# EAGLE design Beagle_ESC (EAGLE 9.0.0)
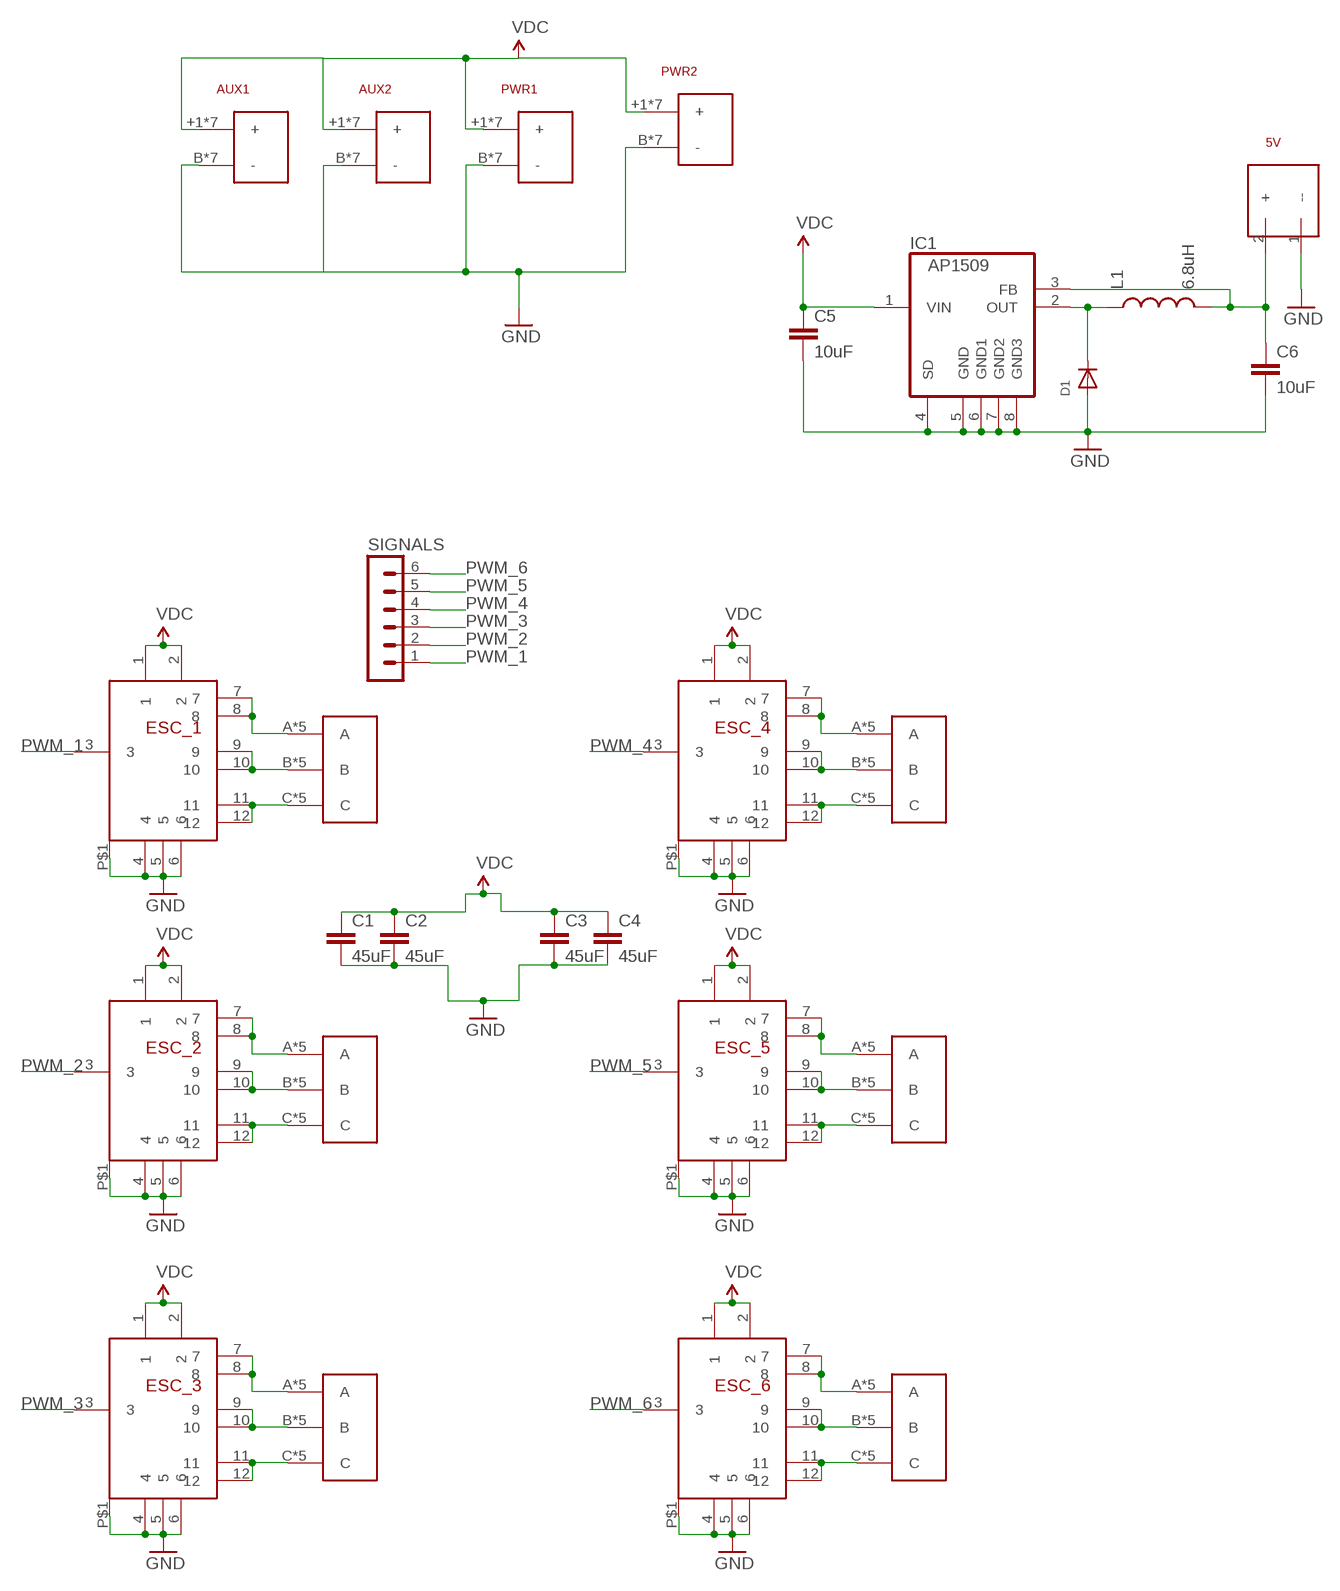
[diagram p0: schematic, sheet 1]

## Parts
1  3_PADS  [3_PADS]
2  3_PADS  [3_PADS]
3  3_PADS  [3_PADS]
4  3_PADS  [3_PADS]
5  3_PADS  [3_PADS]
5V  HEADER_PWR  [HEADER_PWR]
6  3_PADS  [3_PADS]
AUX1  2PADS  [2PADS]
AUX2  2PADS  [2PADS]
C1  45uF  CAP1206  [1206]
C2  45uF  CAP1206  [1206]
C3  45uF  CAP1206  [1206]
C4  45uF  CAP1206  [1206]
C5  10uF  CAP0805  [0805]
C6  10uF  CAP0805  [0805]
D1  DIODESOD-123  [SOD-123]
ESC_1  DYS_BLHELI_ESC  [DYS_BLHELI_ESC]
ESC_2  DYS_BLHELI_ESC  [DYS_BLHELI_ESC]
ESC_3  DYS_BLHELI_ESC  [DYS_BLHELI_ESC]
ESC_4  DYS_BLHELI_ESC  [DYS_BLHELI_ESC]
ESC_5  DYS_BLHELI_ESC  [DYS_BLHELI_ESC]
ESC_6  DYS_BLHELI_ESC  [DYS_BLHELI_ESC]
IC1  AP1509SOIC-8-TIGHT  [SO08-TIGHT]
L1  6.8uH  INDUCTORTAIYO_NR-S  [TAIYO_NRS]
PWR1  2PADS  [2PADS]
PWR2  2PADS  [2PADS]
SIGNALS  MA06-1  [MA06-1]

## Nets
1A: 1.A 1.P$4(A) 1.P$7(A) 1.P$8(A) 1.P$9(A) ESC_1.7 ESC_1.8
1B: 1.B 1.P$5(B) 1.P$10(B) 1.P$11(B) 1.P$12(B) ESC_1.9 ESC_1.10
1C: 1.C 1.P$6(C) 1.P$13(C) 1.P$14(C) 1.P$15(C) ESC_1.11 ESC_1.12
2A: 2.A 2.P$4(A) 2.P$7(A) 2.P$8(A) 2.P$9(A) ESC_2.7 ESC_2.8
2B: 2.B 2.P$5(B) 2.P$10(B) 2.P$11(B) 2.P$12(B) ESC_2.9 ESC_2.10
2C: 2.C 2.P$6(C) 2.P$13(C) 2.P$14(C) 2.P$15(C) ESC_2.11 ESC_2.12
3A: 3.A 3.P$4(A) 3.P$7(A) 3.P$8(A) 3.P$9(A) ESC_3.7 ESC_3.8
3B: 3.B 3.P$5(B) 3.P$10(B) 3.P$11(B) 3.P$12(B) ESC_3.9 ESC_3.10
3C: 3.C 3.P$6(C) 3.P$13(C) 3.P$14(C) 3.P$15(C) ESC_3.11 ESC_3.12
4A: 4.A 4.P$4(A) 4.P$7(A) 4.P$8(A) 4.P$9(A) ESC_4.7 ESC_4.8
4B: 4.B 4.P$5(B) 4.P$10(B) 4.P$11(B) 4.P$12(B) ESC_4.9 ESC_4.10
4C: 4.C 4.P$6(C) 4.P$13(C) 4.P$14(C) 4.P$15(C) ESC_4.11 ESC_4.12
5A: 5.A 5.P$4(A) 5.P$7(A) 5.P$8(A) 5.P$9(A) ESC_5.7 ESC_5.8
5B: 5.B 5.P$5(B) 5.P$10(B) 5.P$11(B) 5.P$12(B) ESC_5.9 ESC_5.10
5C: 5.C 5.P$6(C) 5.P$13(C) 5.P$14(C) 5.P$15(C) ESC_5.11 ESC_5.12
6A: 6.A 6.P$4(A) 6.P$7(A) 6.P$8(A) 6.P$9(A) ESC_6.7 ESC_6.8
6B: 6.B 6.P$5(B) 6.P$10(B) 6.P$11(B) 6.P$12(B) ESC_6.9 ESC_6.10
6C: 6.C 6.P$6(C) 6.P$13(C) 6.P$14(C) 6.P$15(C) ESC_6.11 ESC_6.12
GND: 5V.1(--) AUX1.B(-) AUX1.P$5(-) AUX1.P$10(-) AUX1.P$11(-) AUX1.P$12(-) AUX1.P$13(-) AUX1.P$14(-) AUX2.B(-) AUX2.P$5(-) AUX2.P$10(-) AUX2.P$11(-) AUX2.P$12(-) AUX2.P$13(-) AUX2.P$14(-) C1.2 C2.2 C3.2 C4.2 C5.2 C6.2 D1.A ESC_1.4 ESC_1.5 ESC_1.6 ESC_1.P$1 ESC_2.4 ESC_2.5 ESC_2.6 ESC_2.P$1 ESC_3.4 ESC_3.5 ESC_3.6 ESC_3.P$1 ESC_4.4 ESC_4.5 ESC_4.6 ESC_4.P$1 ESC_5.4 ESC_5.5 ESC_5.6 ESC_5.P$1 ESC_6.4 ESC_6.5 ESC_6.6 ESC_6.P$1 IC1.4(SD) IC1.5(GND) IC1.6(GND1) IC1.7(GND2) IC1.8(GND3) PWR1.B(-) PWR1.P$5(-) PWR1.P$10(-) PWR1.P$11(-) PWR1.P$12(-) PWR1.P$13(-) PWR1.P$14(-) PWR2.B(-) PWR2.P$5(-) PWR2.P$10(-) PWR2.P$11(-) PWR2.P$12(-) PWR2.P$13(-) PWR2.P$14(-)
N$1: D1.C IC1.2(OUT) L1.1
N$2: 5V.2(+) C6.1 IC1.3(FB) L1.2
PWM_1: ESC_1.3 SIGNALS.1
PWM_2: ESC_2.3 SIGNALS.2
PWM_3: ESC_3.3 SIGNALS.3
PWM_4: ESC_4.3 SIGNALS.4
PWM_5: ESC_5.3 SIGNALS.5
PWM_6: ESC_6.3 SIGNALS.6
VCC: AUX1.+1(+) AUX1.+2(+) AUX1.+3(+) AUX1.+4(+) AUX1.+5(+) AUX1.+BOTTOM(+) AUX1.+TOP(+) AUX2.+1(+) AUX2.+2(+) AUX2.+3(+) AUX2.+4(+) AUX2.+5(+) AUX2.+BOTTOM(+) AUX2.+TOP(+) C1.1 C2.1 C3.1 C4.1 C5.1 ESC_1.1 ESC_1.2 ESC_2.1 ESC_2.2 ESC_3.1 ESC_3.2 ESC_4.1 ESC_4.2 ESC_5.1 ESC_5.2 ESC_6.1 ESC_6.2 IC1.1(VIN) PWR1.+1(+) PWR1.+2(+) PWR1.+3(+) PWR1.+4(+) PWR1.+5(+) PWR1.+BOTTOM(+) PWR1.+TOP(+) PWR2.+1(+) PWR2.+2(+) PWR2.+3(+) PWR2.+4(+) PWR2.+5(+) PWR2.+BOTTOM(+) PWR2.+TOP(+) ; supply symbol labelled VDC

## Library data of the parts
1-6 = matts:3_PADS
5V = matts:HEADER_PWR
AUX1 AUX2 PWR1 PWR2 = matts:2PADS
C1-C6 = Strawson_Eagle_Lib:CAP: Capacitor Standard 0603 ceramic capacitor, and 0.1" leaded capacitor.
D1 = adafruit:DIODE: Diode SMADIODE - SMA Surface Mount Package 20V 1A Schottky Diode Digikey: 641-1014-6-ND DO-1N4148 - Through Hole Small Current Diode SOD-123 20V 1 A (.5mV Vf) Schottky Diode - Digikey: MBRX120TPMSCT-ND SOD-323 10V 570mA (.38mV Vf, 3ns) Schottky Diode - Digikey: ZLLS410CT-ND SOD-523 30V 30mA Schottky Diode (RB751S-40TE61) - Digikey: RB751S-40TE61CT-ND SOT23-R/W - SOT23 Package (R = Solder Paste/Reflow Ovens, W = Hand-Soldering) BAT54Film 40V 300mA - Digikey: 497-7162-1-ND
ESC_1-ESC_6 = matts:DYS_BLHELI_ESC
IC1 = Strawson_Eagle_Lib:AP1509: 150KHz, 2A PWM BUCK DC/DC CONVERTER
L1 = Strawson_Eagle_Lib:INDUCTOR: Inductors Basic Inductor/Choke - 0603 and 1206. Footprints are not proven and vary greatly between part numbers. SRN6045- 33uH, 20% 1.4A SDR0403-560KL - 56uH, 10%, 500mA RMS/740mA peak; PROD_ID: NDUC-11627
SIGNALS = matts:MA06-1: PIN HEADER; OC_FARNELL: unknown; OC_NEWARK: unknown

## Board
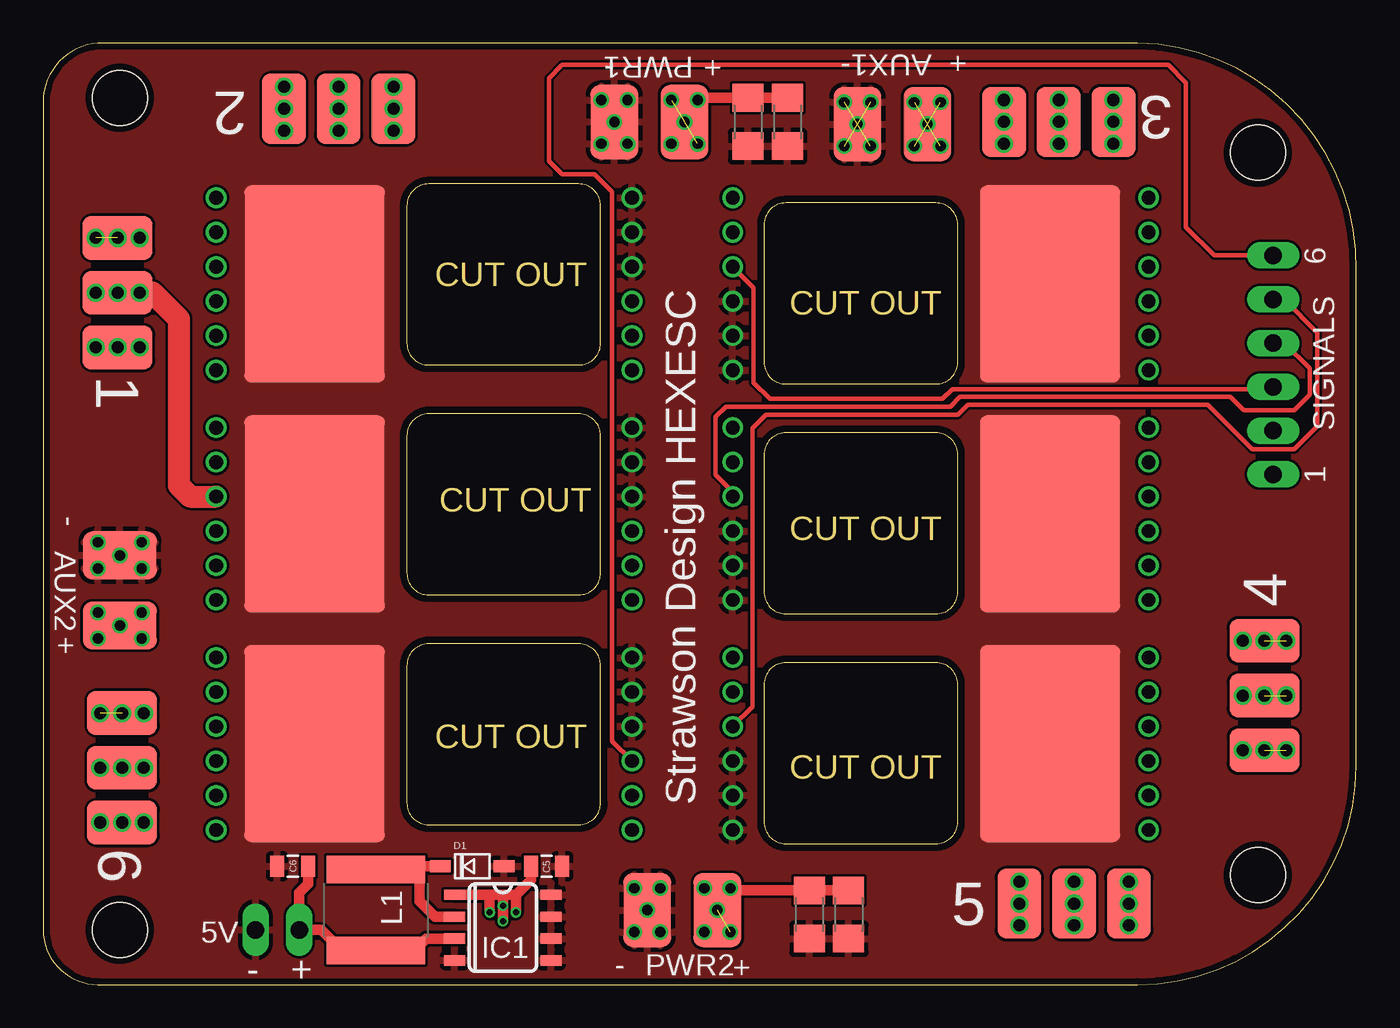
[diagram p1: board, top side]
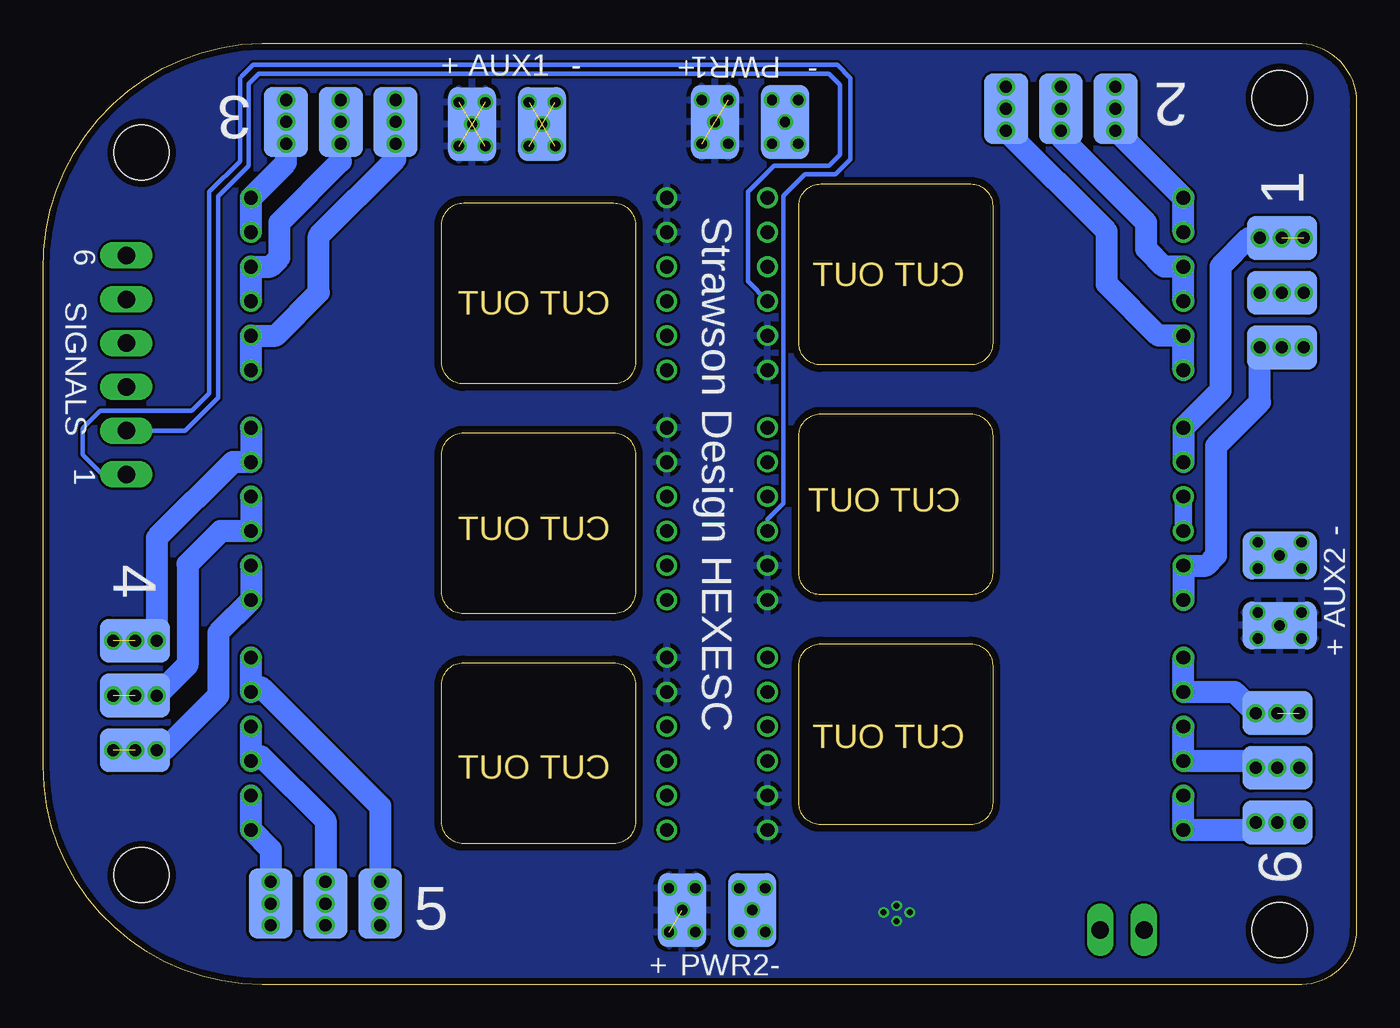
[diagram p2: board, bottom side, seen from below]

Size 76.21 x 54.61 mm. Coordinates in mm from the lower left corner, seen from the top.
Outline: 0.01,50.93 0.01,3.17 arc90 3.18,0 63.51,0 arc90 76.21,12.7 76.21,41.4 arc90 63.51,54.61 3.18,54.61 arc90 0.01,50.93
Copper layers (1*16): Top 0.035559375mm / dielectric 1.6mm / Bottom 0.035559375mm
Design rules "oshpark-2layer": minimum track width 6mil, minimum drill 10mil, track to track 6mil, track to pad 6mil, pad to pad 6mil, via to via 6mil, smd to smd 6mil, copper to edge 15mil, drill to drill 6mil, minimum pad ring 5mil, minimum via ring 5mil, stop-mask expansion 2.5mil, vias tented up to drill 0mil, thermal gap 10mil
Holes 3.17 mm at 70.49,48.26 70.49,6.35 4.45,51.44 4.45,3.17

### Footprints (pad centres in the part's own frame; a part is rotated, then mirrored left to right if it is on the bottom)
3_PADS = smd 4.064 x 2.54: A 0,3.175; B 0,0; C 0,-3.175 | smd 4.064 x 2.54 bottom: P$4 0,3.175; P$5 0,0; P$6 0,-3.175 | drill 0.7: P$7 -1.27,3.175; P$8 0,3.175; P$9 1.27,3.175; P$10 -1.27,0; P$11 0,0; P$12 1.27,0; P$13 -1.27,-3.175; P$14 0,-3.175; P$15 1.27,-3.175
HEADER_PWR = drill 1.016 long: 1 -1.27,0; 2 1.27,0
2PADS = drill 0.6: +1 -1.27,2.794; +2 1.27,2.794; +3 -1.27,1.27; +4 0,2.032; +5 1.27,1.27; P$10 -1.27,-1.27; P$11 0,-2.032; P$12 1.27,-1.27; P$13 -1.27,-2.794; P$14 1.27,-2.794 | smd 4.318 x 2.794 bottom: +BOTTOM 0,2.032; P$5 0,-2.032 | smd 4.318 x 2.794: +TOP 0,2.032; B 0,-2.032
1206 = smd 1.6 x 1.8: 1 -1.4,0; 2 1.4,0
0805 = smd 0.8 x 1.2: 1 -0.9,0; 2 0.9,0
SOD-123 = smd 1.2 x 0.7: A 1.85,0; C -1.85,0
DYS_BLHELI_ESC = drill 0.8: 1 -12.065,5; 2 -12.065,3; 3 -12.065,1; 4 -12.065,-1; 5 -12.065,-3; 6 -12.065,-5; 7 12.065,-5; 8 12.065,-3; 9 12.065,-1; 10 12.065,1; 11 12.065,3; 12 12.065,5 | smd 8.128 x 11.43: P$1 6.35,0
SO08-TIGHT = smd 0.6 x 1.2: 1 -1.905,-2.8; 2 -0.635,-2.8; 3 0.635,-2.8; 4 1.905,-2.8; 5 1.905,2.8; 6 0.635,2.8; 7 -0.635,2.8; 8 -1.905,2.8
TAIYO_NRS = smd 1.6 x 5.7: 1 -2.349,0; 2 2.349,0
MA06-1 = drill 1.016 long: 1 -6.35,0; 2 -3.81,0; 3 -1.27,0; 4 1.27,0; 5 3.81,0; 6 6.35,0

### Placement (x,y rotation side)
1  4.33,40.13 0 top
2  17.15,50.8 90 top
3  58.94,50.04 90 top
4  70.87,16.76 180 top
5  59.83,4.7 270 top
5V  13.6,3.17 0 top
6  4.58,12.57 0 top
AUX1  49.28,49.91 270 top
AUX2  4.45,22.86 180 top
C1  43.19,50.04 270 top
C2  44.46,4.06 270 top
C3  40.9,50.04 270 top
C4  46.74,4.06 270 top
C5  29.22,6.86 0 top
C6  14.49,6.86 180 top
D1  24.9,6.86 0 top
ESC_1  22.11,27.3 180 top
ESC_2  22.11,40.64 180 top
ESC_3  52.08,40.64 0 top
ESC_4  52.08,27.3 0 top
ESC_5  52.08,13.97 0 top
ESC_6  22.11,13.97 180 top
IC1  26.68,3.3 270 top
L1  19.31,4.32 270 top
PWR1  35.19,50.04 270 top
PWR2  37.09,4.32 270 top
SIGNALS  71.38,35.94 90 top

### Tracks (layer width: path | path; a pad name or v marks a point on that pad's centre or on a via)
1A  (1 unrouted)
  Bottom 1.016: 1.P$9 1.P$8
  Bottom 1.27: ESC_1.8 ESC_1.7 7.88,34.46 7.88,41.66 6.23,43.31 1.P$8
1B
  Top 1.27: 1.P$11 6.36,40.13 7.88,38.61 7.88,28.96 8.53,28.3 ESC_1.9
  Bottom 1.016: 1.P$12 1.P$11 1.P$10 | ESC_1.9 ESC_1.10
1C
  Bottom 1.016: 1.P$15 1.P$14 1.P$13
  Bottom 1.27: ESC_1.12 ESC_1.11 8.72,24.3 8.14,24.89 8.14,31.24 5.6,33.78 1.P$15
2A
  Top 1.016: 2.P$7 2.P$8 2.P$9
  Bottom 1.27: ESC_2.8 ESC_2.7 13.93,49.53 2.P$7
2B
  Top 1.016: 2.P$12 2.P$11 2.P$10
  Bottom 1.27: ESC_2.10 ESC_2.9 11.17,41.64 12.2,42.67 12.2,44.2 17.15,49.15 2.P$10
2C
  Top 1.016: 2.P$13 2.P$14 2.P$15
  Bottom 1.27: ESC_2.12 ESC_2.11 11.49,37.64 14.49,40.64 14.49,43.69 2.P$13
3A
  Bottom 1.016: 3.P$7 3.P$8 3.P$9
  Bottom 1.27: ESC_3.7 ESC_3.8 62.7,37.64 60.21,40.13 60.21,43.43 55.76,47.88 3.P$7
3B
  Bottom 1.016: 3.P$10 3.P$11 3.P$12
  Bottom 1.27: ESC_3.9 ESC_3.10 63.02,41.64 62.49,42.16 62.49,44.2 58.94,47.75 3.P$10
3C
  Bottom 1.016: 3.P$13 3.P$14 3.P$15
  Bottom 1.27: ESC_3.11 ESC_3.12 62.11,47.67 3.P$13
4A  (1 unrouted)
  Bottom 1.016: 4.P$8 4.P$9 69.22,13.59
  Bottom 1.27: ESC_4.8 ESC_4.7 66.05,20.4 66.05,16.76 69.22,13.59
4B  (1 unrouted)
  Bottom 1.016: 4.P$11 4.P$12
  Bottom 1.27: ESC_4.10 ESC_4.9 65.91,26.3 67.83,24.38 67.83,18.54 4.P$12
4C  (1 unrouted)
  Bottom 1.016: 4.P$15 4.P$14
  Bottom 1.27: ESC_4.12 ESC_4.11 65.21,30.3 69.6,25.91 4.P$15
5A
  Top 1.016: 5.P$7 5.P$8 5.P$9
  Bottom 1.27: ESC_5.8 ESC_5.7 63,7.83 5.P$7
5B
  Top 1.016: 5.P$12 5.P$11 5.P$10
  Bottom 1.27: ESC_5.10 ESC_5.9 63.64,13.22 63.53,13.22 59.83,9.52 5.P$10
5C
  Top 1.016: 5.P$13 5.P$14 5.P$15
  Bottom 1.27: ESC_5.12 ESC_5.11 63.64,17.22 63.53,17.22 56.65,10.35 5.P$13
6A  (1 unrouted)
  Top 0.813: 6.P$9 6.P$8
  Bottom 1.27: ESC_6.7 ESC_6.8 7.07,16.97 6.P$9
6B
  Bottom 1.016: 6.P$12 6.P$11
  Bottom 1.27: ESC_6.9 ESC_6.10 6.25,12.97 6.P$12 | 6.P$10 6.P$11
6C
  Bottom 1.016: 6.P$15 6.P$14
  Bottom 1.27: ESC_6.11 ESC_6.12 6.28,8.97 6.P$15 | 6.P$13 6.P$14
GND  (4 unrouted)
  Bottom 1.016: AUX2.P$13 AUX2.P$11 | AUX2.P$10 AUX2.P$11 | AUX2.P$12 AUX2.P$11 | AUX2.P$14 AUX2.P$11
  Bottom 1.27: PWR2.P$13 PWR2.P$5 | PWR2.P$5 PWR2.P$10 | PWR2.P$5 PWR2.P$12 | PWR2.P$5 PWR2.P$14 | PWR1.P$13 PWR1.P$5 | PWR1.P$5 PWR1.P$10 | PWR1.P$5 PWR1.P$12 | PWR1.P$14 PWR1.P$5
  pour Top: -2.53,59.69 77.48,59.18 78.49,-1.78 -1.77,-1.52
N$1
  Top 0.152: 21.85,6.35 21.53,6.67 L1.1 20.9,6.67 21.09,6.86
  Top 0.61: IC1.2 22.74,3.94 21.85,4.83 21.85,6.35 | 21.09,6.86 D1.C
N$2
  Top 0.61: IC1.3 22.23,2.67 21.85,2.29 21.85,2.03 19.38,2.03 L1.2 17.34,1.97 16.14,3.17 5V.2 14.87,5.33 15.39,5.85 C6.1
PWM_1
  Bottom 0.254: SIGNALS.1 72.78,29.59 73.92,30.73 73.92,32.26 72.91,33.27 67.57,33.27 66.56,34.29 66.56,45.97 64.78,47.75 64.78,52.58 64.68,52.68 64.02,53.34 30.11,53.34 29.35,52.58 29.35,47.88 30.23,46.99 32.01,46.99 33.24,45.76 33.24,27.92 34.17,26.98 ESC_1.3
PWM_2
  Bottom 0.254: SIGNALS.2 67.95,32.13 66.05,34.04 66.05,45.72 64.27,47.5 64.27,52.26 63.7,52.83 30.62,52.83 29.98,52.2 29.98,48.13 30.62,47.5 33.79,47.5 35.31,45.97 35.31,40.78 ESC_2.3
PWM_3
  Top 0.254: ESC_3.3 41.22,40.43 41.22,34.92 42.17,33.98 52.2,33.98 52.77,34.54 71.26,34.54 SIGNALS.3
PWM_4
  Top 0.254: SIGNALS.4 72.02,37.21 73.49,35.74 73.49,34.22 72.6,33.33 69.66,33.33 68.9,34.09 53.21,34.09 52.64,33.52 39.62,33.52 39.03,32.92 39.03,29.56 40.01,28.57 ESC_4.3
PWM_5
  Top 0.254: ESC_5.3 41.16,16.11 41.16,32.26 41.96,33.06 53.09,33.06 53.65,33.63 67.58,33.63 70.17,31.04 72.6,31.04 73.95,32.39 73.95,37.82 72.02,39.75 SIGNALS.5
PWM_6
  Top 0.254: ESC_6.3 33.03,14.11 33.03,45.97 32.01,46.99 30.11,46.99 29.35,47.75 29.35,52.58 30.11,53.34 65.29,53.34 66.3,52.32 66.3,43.94 67.95,42.29 SIGNALS.6
VCC  (via drill 0.35)  (7 unrouted)
  Top 0.61: PWR1.+1 38.11,51.44 C3.1 C1.1 | C4.1 C2.1 40.02,5.46 PWR2.+1 | IC1.1 25.92,5.21 | 26.68,5.21 27.44,5.21 | 27.44,5.21 28.32,6.08 C5.1 | 25.92,5.21 v25.92,4.19 | 26.68,5.21 v26.68,4.57 v26.68,3.68 | 27.44,5.21 v27.44,4.19 | 25.92,5.21 26.68,5.21
  Bottom 0.406: AUX2.+5 AUX2.+4 AUX2.+1
  Bottom 1.016: AUX2.+3 AUX2.+4 AUX2.+2
  Bottom 1.27: PWR1.+5 PWR1.+4 PWR1.+1 | PWR2.+5 PWR2.+4 | PWR2.+4 PWR2.+1 | PWR2.+4 PWR2.+3
  pour Bottom: -2.53,58.17 -3.04,-4.06 81.03,-3.05 81.29,57.66

### Text on the board
Dimension: CUT OUT | CUT OUT | CUT OUT | CUT OUT | CUT OUT | CUT OUT
bPlace: 6 | SIGNALS | 1
tNames: - | + | - | + | - | + | Strawson Design HEXESC | - | +
bNames: - | + | - | + | Strawson Design HEXESC | - | + | - | +